# Altium schematic sheet FuentesExtras.SchDoc
size A4
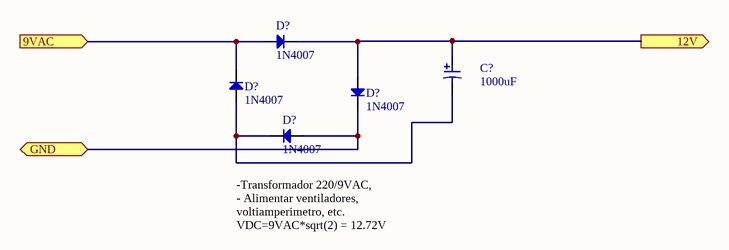
[diagram p0: FuentesExtras.SchDoc]

## Parts
(Parts that share a designator on the sheet are numbered #1, #2 ... from top to bottom, then left to right.)
C?  value 1000uF  [C Elec SMD 6.3x5.4]  (hidden comment: C-Pol-1000uF-4x6.3)
D?#1  1N4007  [DO-35 Glass]
D?#2  1N4007  [DO-35 Glass]
D?#3  1N4007  [DO-35 Glass]
D?#4  1N4007  [DO-35 Glass]

## Ports
9VAC (in), 12V (out), GND (bidir)

## Nets
9VAC: D?#1.2 D?#2.1 ; port 9VAC
12V: C?.2 D?#1.1 D?#3.2 ; port 12V
GND: D?#3.1 D?#4.2 ; port GND
NetC?_1: C?.1 D?#2.2 D?#4.1

## Notes on the sheet
- (near D?#4) -Transformador 220/9VAC,
  - Alimentar ventiladores, voltiamperimetro, etc.
  VDC=9VAC*sqrt(2) = 12.72V

## Library data of the parts
C? = C-Pol-1000uF-4x6.3: Capacitor, polarized, generic; Manofacturer: Mouser; Manofacturer Supply Numb: UCM1C102MNL1GS
D?#1-D?#4 = D-UF4004-TP-DO-41: Diodes - General Purpose, Power, Switching Hi Conductance Fast; Manofacturer: Micro Commercial Components (MCC); Manufacturer Code: UF4004-TP; Category: Diodes - General Purpose, Power, Switching; Pricing: 0.094; Supplier: Mouser; Supplier Number Code: 833-UF4004-TP; Value: *